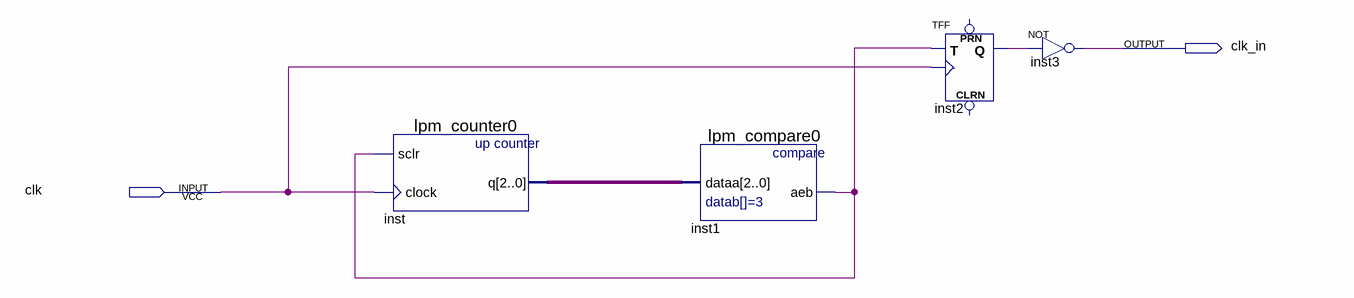
[diagram p0: schematic sheet]
// Quartus schematic BlockA.bdf as structural Verilog: 4 symbols, 2 pins
module BlockA (
  input  clk,
  output clk_in
);

  wire inst1_aeb, inst2_q;
  wire [2:0] inst_q;

  lpm_counter0 inst (.sclr(inst1_aeb), .clock(clk), .q(inst_q));
  lpm_compare0 inst1 (.dataa(inst_q), .aeb(inst1_aeb));
  TFF inst2 (.T(inst1_aeb), .CLK(clk), .Q(inst2_q));  // open: PRN, CLRN
  not inst3 (clk_in, inst2_q);
endmodule
